# Altium schematic sheet arm_board.SchDoc
size A4
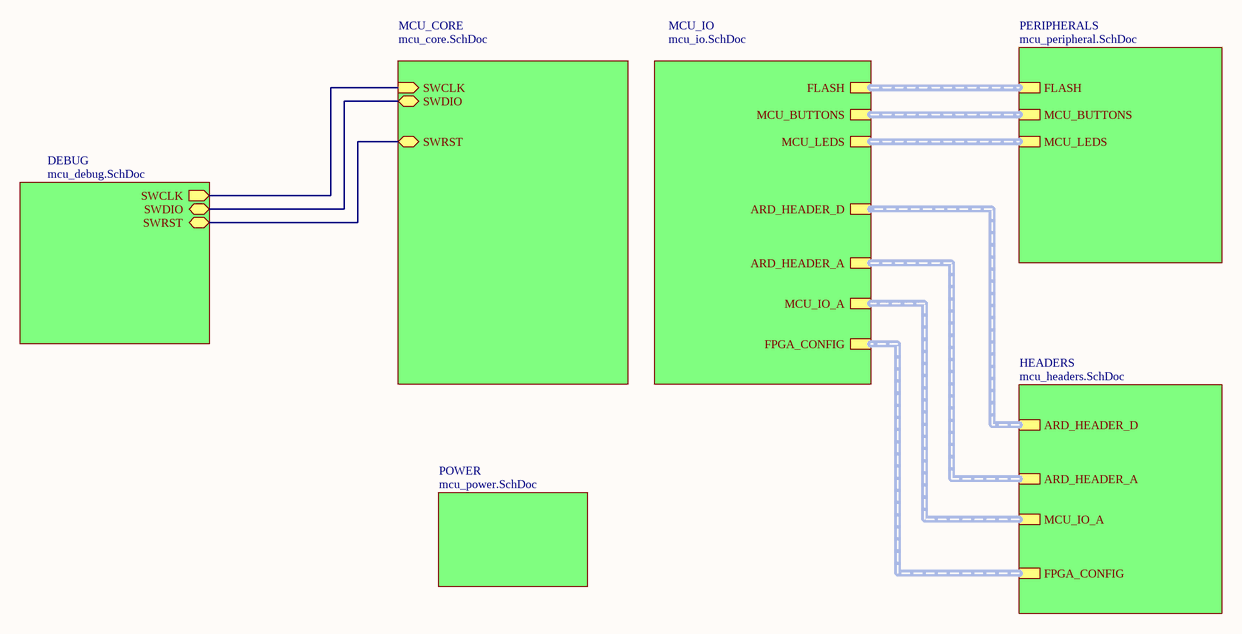
[diagram p0: arm_board.SchDoc]

## Sub-sheets
DEBUG = mcu_debug.SchDoc: SWCLK (out), SWDIO (bidir), SWRST (bidir)
HEADERS = mcu_headers.SchDoc: ARD_HEADER_D (harness ARD_HEADER_D), ARD_HEADER_A (harness ARD_HEADER_A), MCU_IO_A (harness MCU_IO_A), FPGA_CONFIG (harness FPGA_CONFIG)
MCU_CORE = mcu_core.SchDoc: SWDIO (bidir), SWCLK (in), SWRST (bidir)
MCU_IO = mcu_io.SchDoc: FLASH (harness FLASH), MCU_BUTTONS (harness MCU_BUTTONS), MCU_LEDS (harness MCU_LEDS), ARD_HEADER_D (harness ARD_HEADER_D), ARD_HEADER_A (harness ARD_HEADER_A), MCU_IO_A (harness MCU_IO_A), FPGA_CONFIG (harness FPGA_CONFIG)
PERIPHERALS = mcu_peripheral.SchDoc: FLASH (harness FLASH), MCU_BUTTONS (harness MCU_BUTTONS), MCU_LEDS (harness MCU_LEDS)
POWER = mcu_power.SchDoc: no entries

## Nets
(unnamed): sheet MCU_CORE/SWDIO, sheet DEBUG/SWDIO
(unnamed): sheet MCU_CORE/SWCLK, sheet DEBUG/SWCLK
(unnamed): sheet MCU_CORE/SWRST, sheet DEBUG/SWRST

## Buses and harness runs
harness sheet HEADERS/ARD_HEADER_A = sheet MCU_IO/ARD_HEADER_A
harness sheet HEADERS/ARD_HEADER_D = sheet MCU_IO/ARD_HEADER_D
harness sheet HEADERS/FPGA_CONFIG = sheet MCU_IO/FPGA_CONFIG
harness sheet HEADERS/MCU_IO_A = sheet MCU_IO/MCU_IO_A
harness sheet MCU_IO/FLASH = sheet PERIPHERALS/FLASH
harness sheet MCU_IO/MCU_BUTTONS = sheet PERIPHERALS/MCU_BUTTONS
harness sheet MCU_IO/MCU_LEDS = sheet PERIPHERALS/MCU_LEDS